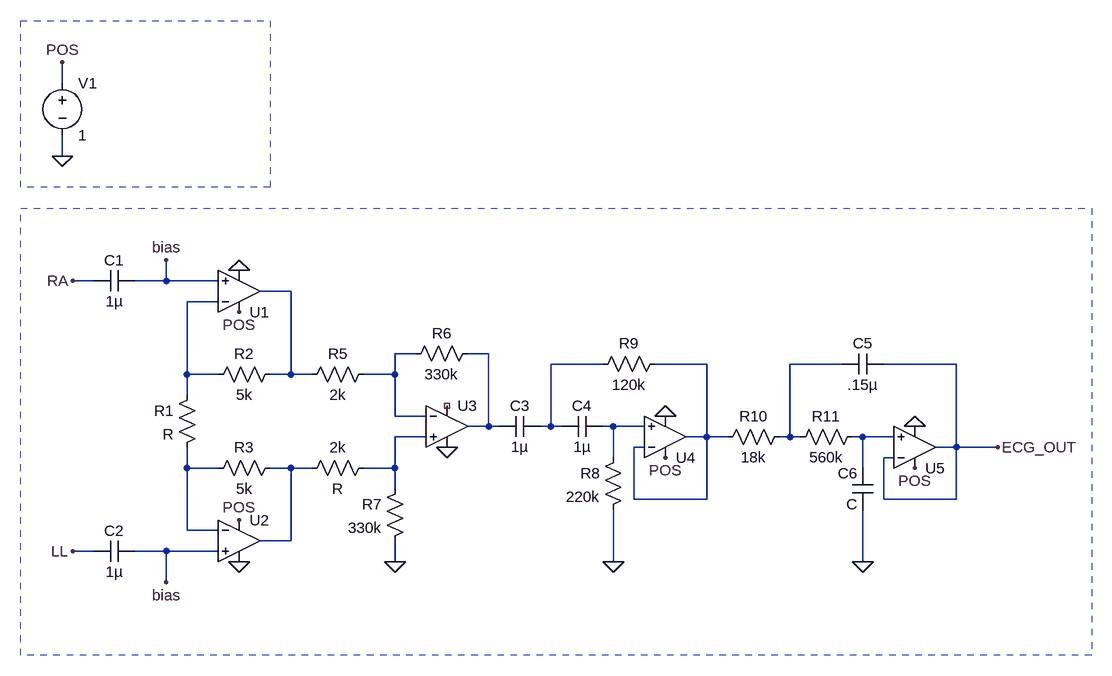
[diagram p0: schematic ECG-Bridge.asc]
ECG-Bridge.asc, the LTspice schematic file:
Version 4.1
SHEET 1 1220 680
WIRE -368 -352 -368 -384
WIRE -368 -240 -368 -272
WIRE -320 -48 -352 -48
WIRE -208 -48 -208 -80
WIRE -208 -48 -256 -48
WIRE -128 -48 -208 -48
WIRE -16 -32 -64 -32
WIRE -128 -16 -176 -16
WIRE 176 64 144 64
WIRE 288 64 256 64
WIRE 464 80 384 80
WIRE 624 80 544 80
WIRE 832 80 752 80
WIRE 1008 80 896 80
WIRE -176 96 -176 -16
WIRE -128 96 -176 96
WIRE -16 96 -16 -32
WIRE -16 96 -48 96
WIRE 16 96 -16 96
WIRE 144 96 144 64
WIRE 144 96 96 96
WIRE -176 128 -176 96
WIRE 144 160 144 96
WIRE 192 160 144 160
WIRE 288 176 288 64
WIRE 288 176 256 176
WIRE 304 176 288 176
WIRE 384 176 384 80
WIRE 384 176 368 176
WIRE 400 176 384 176
WIRE 480 176 464 176
WIRE 528 176 480 176
WIRE 192 192 144 192
WIRE 624 192 624 80
WIRE 624 192 592 192
WIRE 656 192 624 192
WIRE 752 192 752 80
WIRE 752 192 736 192
WIRE 768 192 752 192
WIRE 864 192 848 192
WIRE 912 192 864 192
WIRE 528 208 512 208
WIRE 1008 208 1008 80
WIRE 1008 208 976 208
WIRE 1072 208 1008 208
WIRE 480 224 480 176
WIRE 912 224 896 224
WIRE -176 240 -176 208
WIRE -128 240 -176 240
WIRE -16 240 -48 240
WIRE 16 240 -16 240
WIRE 144 240 144 192
WIRE 144 240 96 240
WIRE 864 240 864 192
WIRE 144 272 144 240
WIRE 512 288 512 208
WIRE 624 288 624 192
WIRE 624 288 512 288
WIRE 896 288 896 224
WIRE 1008 288 1008 208
WIRE 1008 288 896 288
WIRE -176 336 -176 240
WIRE -128 336 -176 336
WIRE -16 352 -16 240
WIRE -16 352 -64 352
WIRE -320 368 -352 368
WIRE -208 368 -256 368
WIRE -128 368 -208 368
WIRE 144 384 144 352
WIRE 480 384 480 304
WIRE 864 384 864 304
WIRE -208 416 -208 368
FLAG 144 384 0
FLAG 480 384 0
FLAG 864 384 0
FLAG -96 384 0
FLAG -96 -64 0
FLAG 224 208 0
FLAG 560 160 0
FLAG 944 176 0
FLAG 1072 208 ECG_OUT
FLAG -208 416 bias
FLAG -208 -80 bias
FLAG -352 -48 RA
FLAG -352 368 LL
FLAG -368 -240 0
FLAG -368 -384 POS
FLAG -96 0 POS
FLAG -96 320 POS
FLAG 560 224 POS
FLAG 944 240 POS
SYMBOL OpAmps\\UniversalOpAmp1 -96 -32 M180
SYMATTR InstName U1
SYMBOL OpAmps\\UniversalOpAmp1 -96 352 R0
SYMATTR InstName U2
SYMBOL OpAmps\\UniversalOpAmp1 224 176 R0
SYMATTR InstName U3
SYMBOL OpAmps\\UniversalOpAmp1 560 192 M180
SYMATTR InstName U4
SYMBOL OpAmps\\UniversalOpAmp1 944 208 M180
SYMATTR InstName U5
SYMBOL cap -256 -64 R90
WINDOW 0 0 32 VBottom 2
WINDOW 3 32 32 VTop 2
SYMATTR InstName C1
SYMATTR Value 1µ
SYMBOL cap -256 352 R90
WINDOW 0 0 32 VBottom 2
WINDOW 3 32 32 VTop 2
SYMATTR InstName C2
SYMATTR Value 1µ
SYMBOL cap 368 160 R90
WINDOW 0 0 32 VBottom 2
WINDOW 3 32 32 VTop 2
SYMATTR InstName C3
SYMATTR Value 1µ
SYMBOL cap 464 160 R90
WINDOW 0 0 32 VBottom 2
WINDOW 3 32 32 VTop 2
SYMATTR InstName C4
SYMATTR Value 1µ
SYMBOL cap 896 64 R90
WINDOW 0 0 32 VBottom 2
WINDOW 3 32 32 VTop 2
SYMATTR InstName C5
SYMATTR Value .15µ
SYMBOL res -160 112 M0
SYMATTR InstName R1
SYMBOL res -32 80 R90
WINDOW 0 0 56 VBottom 2
WINDOW 3 32 56 VTop 2
SYMATTR InstName R2
SYMATTR Value 5k
SYMBOL res -32 224 R90
WINDOW 0 0 56 VBottom 2
WINDOW 3 32 56 VTop 2
SYMATTR InstName R3
SYMATTR Value 5k
SYMBOL res 112 224 R90
WINDOW 0 0 56 VBottom 2
WINDOW 3 32 56 VTop 2
SYMATTR InstName 2k
SYMBOL res 112 80 R90
WINDOW 0 0 56 VBottom 2
WINDOW 3 32 56 VTop 2
SYMATTR InstName R5
SYMATTR Value 2k
SYMBOL res 272 48 R90
WINDOW 0 0 56 VBottom 2
WINDOW 3 32 56 VTop 2
SYMATTR InstName R6
SYMATTR Value 330k
SYMBOL res 160 256 M0
SYMATTR InstName R7
SYMATTR Value 330k
SYMBOL res 496 208 M0
SYMATTR InstName R8
SYMATTR Value 220k
SYMBOL res 560 64 R90
WINDOW 0 0 56 VBottom 2
WINDOW 3 32 56 VTop 2
SYMATTR InstName R9
SYMATTR Value 120k
SYMBOL res 752 176 R90
WINDOW 0 0 56 VBottom 2
WINDOW 3 32 56 VTop 2
SYMATTR InstName R10
SYMATTR Value 18k
SYMBOL res 864 176 R90
WINDOW 0 0 56 VBottom 2
WINDOW 3 32 56 VTop 2
SYMATTR InstName R11
SYMATTR Value 560k
SYMBOL cap 880 240 M0
SYMATTR InstName C6
SYMBOL voltage -368 -368 R0
WINDOW 123 0 0 Left 0
WINDOW 39 0 0 Left 0
SYMATTR InstName V1
SYMATTR Value 1
RECTANGLE Normal 1216 528 -432 -160 2
RECTANGLE Normal -48 -192 -432 -448 2

The netlist it stands for:
* ECG-Bridge.asc
X§U1 bias N002 POS 0 N001 level1 Avol=1Meg GBW=10Meg Vos=0 En=0 Enk=0 In=0 Ink=0 Rin=500Meg  ; pins In+ In- V+ V- OUT
X§U2 bias N011 POS 0 N012 level1 Avol=1Meg GBW=10Meg Vos=0 En=0 Enk=0 In=0 Ink=0 Rin=500Meg  ; pins In+ In- V+ V- OUT
X§U3 N009 N003 NC_01 0 N004 level1 Avol=1Meg GBW=10Meg Vos=0 En=0 Enk=0 In=0 Ink=0 Rin=500Meg  ; pins In+ In- V+ V- OUT
X§U4 N008 N006 POS 0 N006 level1 Avol=1Meg GBW=10Meg Vos=0 En=0 Enk=0 In=0 Ink=0 Rin=500Meg  ; pins In+ In- V+ V- OUT
X§U5 N010 ECG_OUT POS 0 ECG_OUT level1 Avol=1Meg GBW=10Meg Vos=0 En=0 Enk=0 In=0 Ink=0 Rin=500Meg  ; pins In+ In- V+ V- OUT
C1 bias RA 1µ
C2 bias LL 1µ
C3 N005 N004 1µ
C4 N008 N005 1µ
C5 ECG_OUT N007 .15µ
R1 N002 N011 R
R2 N001 N002 5k
R3 N012 N011 5k
R§2k N009 N012 R
R5 N003 N001 2k
R6 N004 N003 330k
R7 N009 0 330k
R8 N008 0 220k
R9 N006 N005 120k
R10 N007 N006 18k
R11 N010 N007 560k
C6 N010 0 C
V1 POS 0 1
.lib UniversalOpAmp1.lib
.backanno
.end